# Altium schematic sheet PowerPlant.SchDoc
size A; SheetNumber: 4; SheetTotal: 4
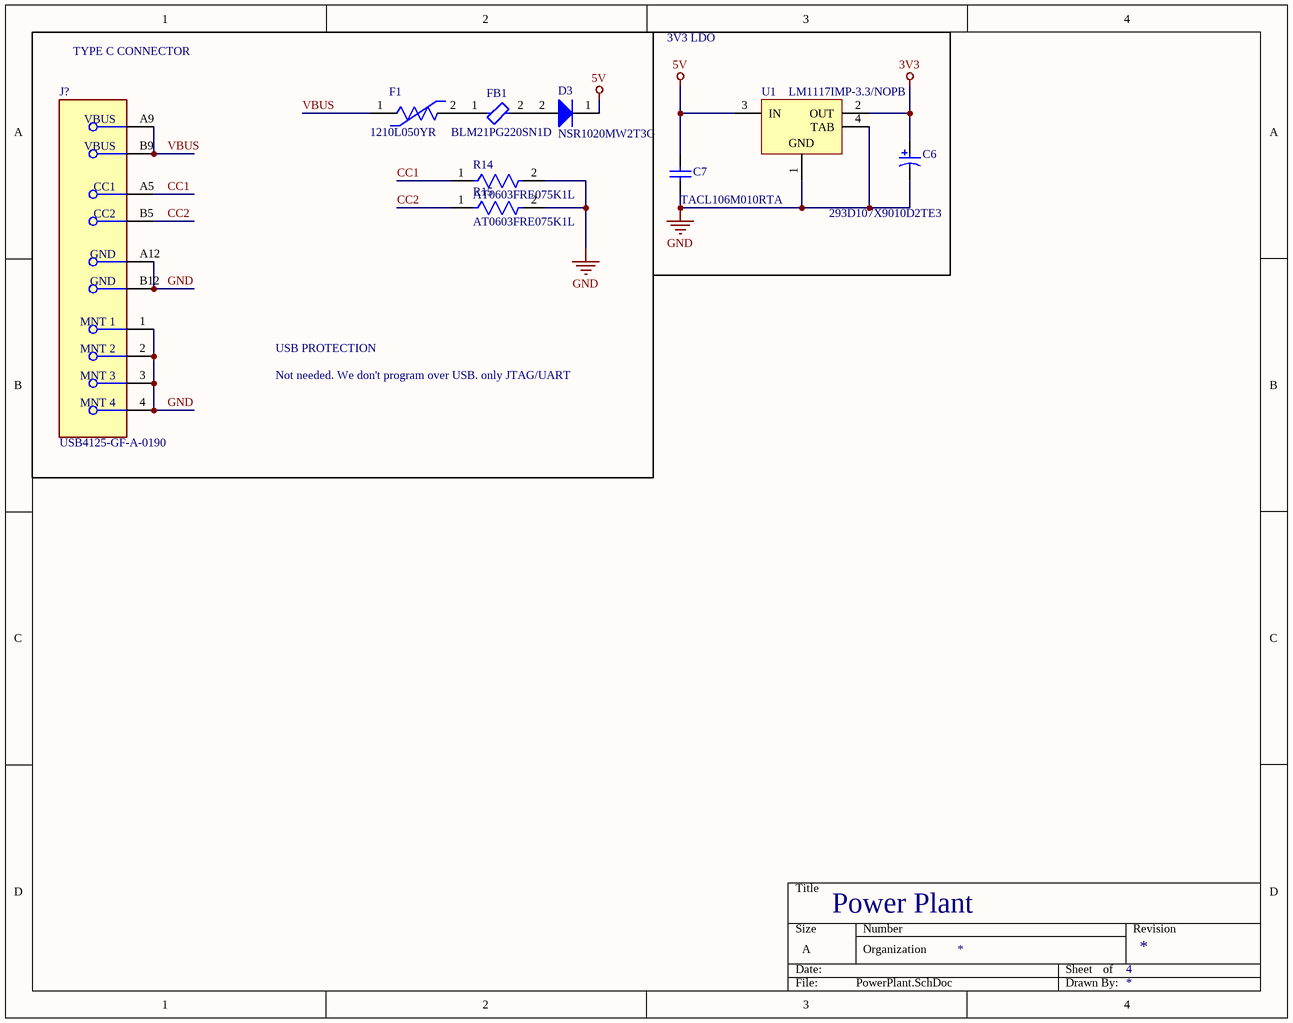
[diagram p0: PowerPlant.SchDoc]

## Parts
C6  293D107X9010D2TE3  [VISH-7343-31_N]
C7  TACL106M010RTA  [CAPC1609X100X15NL20]
D3  NSR1020MW2T3G  [ONSC-SOD-323-2-477-02_V]
F1  1210L050YR  [FP-1210L050YR-MFG]
FB1  BLM21PG220SN1D  [FP-BLM21-0_2-t0_85-e0_5-MFG]
J?  USB4125-GF-A-0190  [FP-USB4125-GF-A-0190-MFG]
R14  AT0603FRE075K1L  [FP-AT0603-IPC_B]
R15  AT0603FRE075K1L  [FP-AT0603-IPC_B]
U1  LM1117IMP-3.3/NOPB  [DCY0004A_N]

## Nets
3V3: C6.1 U1.2(OUT)
5V: C7.2 D3.1(K) U1.3(IN)
GND: C6.2 C7.1 J?.1(MNT_1) J?.2(MNT_2) J?.3(MNT_3) J?.4(MNT_4) J?.A12(GND) J?.B12(GND) R14.2 R15.2 U1.1(GND) U1.4(TAB)
CC1: J?.A5(CC1) R14.1
CC2: J?.B5(CC2) R15.1
VBUS: F1.1 J?.A9(VBUS) J?.B9(VBUS)
NetD3_2: D3.2(A) FB1.2
NetF1_2: F1.2 FB1.1

## Notes on the sheet
- TYPE C CONNECTOR
- 3V3 LDO
- USB PROTECTION
- Not needed. We don't program over USB. only JTAG/UART
- Power Plant
- Organization

## Library data of the parts
C6 = CMP-1666-00024-1: Solid Tantalum Chip Capacitor, 100 uF, +/- 10%, 10 V, -55 to 125 degC, 2917 (7343 Metric), RoHS, Tape and Reel; Voltage Rating (DC): 50 V; Case\Package: 0603; Resistance: 1.2 kohm; Power Rating: 100 mW; Tolerance: 1%; ComponentLink2URL: http://www.vishay.com/docs/40002/293d.pdf; Max Operating Temperature: 155 degC; Length: 1.6 mm; Mount: Surface Mount; Pins: 2; RoHSCompliant: true; ComponentLink1URL: http://www.vishay.com/; DatasheetVersion: Aug-16; REACH SVHC: No SVHC; Height: 0.45 mm; Width: 0.8 mm; Min Operating Temperature: -55 degC; ComponentLink2Description: Datasheet; Case Code (Metric): 1608; Case Code (Imperial): 0603; Packaging: Tape and Reel; PackageReference: 7343-31; Package Quantity: 200; Voltage Rating: 50 V; PackageDescription: 2-Pin Surface Mount Device, Body 7.3 x 4.3 mm; ComponentLink1Description: Manufacturer URL
C7 = CMP-2006-00192-1: Manufacturer: AVX Interconnect / Elco; Part Number: TACL106M010RTA
D3 = CMP-1055-00469-1: Schottky Barrier Diode, 2-Pin SOD-323, Pb-Free, Tape and Reel; Manufacturer: On Semiconductor; IFSM Max (A): 5; Configuration: Single; PartNumber: NSR1020MW2T3G; RoHS: TRUE; ComponentLink2Description: Datasheet; PackageVersion: Rev. H, 03/2007; ComponentLink3Description: Package Specification; ComponentLink1Description: Manufacturer URL; DatasheetVersion: Rev. 1; PackageDescription: 2-Pin SOD, Body 1.7 x 1.25 mm; ComponentLink2URL: http://www.onsemi.cn/pub_link/Collateral/NSR1020MW2T1-D.PDF; Packing: Tape and Reel; ComponentLink3URL: http://www.onsemi.com/pub_link/Collateral/477-02.PDF.1; PackageReference: SOD-323-2-477-02; ComponentLink1URL: http://www.onsemi.com/; Mounting Technology: Surface Mount
F1 = CMP-08606-000067-1: PTC RESET FUSE 13.2V 500MA 1210; Approvals: cULus; Resistance: 900mR; Time to Trip: 0.1s; Max Current Rating: 100A; Trip Current: 1A; Max Power Dissipation: 600mW; Case Code (Metric): 3225; Min Operating Temperature: -40°C; Max Voltage Rating (DC): 13.2V; Hold Current: 500mA; Working Voltage: 13.2V; Termination: SMD/SMT; Case Code (Imperial): 1210; Current Rating: 100A; REACH SVHC: No SVHC; Width: 2.8mm; Lead Free: Lead Free; Length: 3.43mm; Voltage Rating (DC): 13.2V; Packaging: Tape and Reel; Terminal Material: Copper; Voltage Rating: 13.2V; Height: 0.85mm; Case/Package: 1210; Package Quantity: 4000; Max Operating Temperature: 85°C; Power Dissipation: 600mW; Operating Supply Voltage: 13.2V
FB1 = CMP-0686-00622-4: Chip Ferrite Bead, 0805, 22Ω @ 100MHz, 0.009Ω, 25%, 6A; Manufacturer Series: BLM21P; Resistance: 10mR; DC Resistance-Max: 9mR; Material: Steel; Number of Circuits: 1; Impedance: 22R; Shielding: Unshielded; DC Current: 6A; Termination: SMD/SMT; Max Operating Temperature: 125°C; Case Code (Metric): 2012; Radiation Hardening: No; Length: 2mm; Case Code (Imperial): 0805; RoHS Compliant: Yes; Max Current Rating: 6A; DC Resistance (DCR): 9mR; Case/Package: 0805; Core Material: Ferrite; Width: 1.25mm; Weight: 0.000194oz; Number of Pins: 2; Packaging: Tape and Reel; REACH SVHC: No SVHC; Tolerance: 25%; Height: 0.85mm; Number of Functions: 1; Lead Free: Lead Free; Terminal Finish: Tin; Number of Lines: 1; Package Quantity: 1; Series: BLM21P; Test Frequency: 100MHz; Min Operating Temperature: -55°C; Max DC Current: 6A; Current Rating: 6A; Depth: 1.25mm
J? = CMP-245163-000004-1: CONN RCPT TYPE C 6P SMD RA
R14 R15 = CMP-03412-047308-1: Thin Film Chip Resistors Automotive Grade 5.1kΩ 1% 50ppm/°C 0603
U1 = CMP-0062-01631-4: 800mA Low-Dropout Linear Regulator, 4-pin SOT-223, Pb-Free; Manufacturer: Texas Instruments; PackageTopMarking: XYTT*N05B; PowerWise: N; High-Reliability: Y; CompType: LDO IC; Code_IPC: SOT223-4; PackageReference: DCY0004A; PinCount: 4; PackageDescription: Molded SOT-223, 6.50 x 3.56 x 1.6mm Body, 4 Lead, 2.3mm Pitch; PartNumber: LM1117IMP-3.3/NOPB; RoHS: Y; ComponentLink1Description: Datasheet URL; Code_JEDEC: TO-261-AA; ComponentLink1URL: http://www.ti.com/general/docs/lit/getliterature.tsp?genericPartNumber=LM1117-N&fileType=pdf